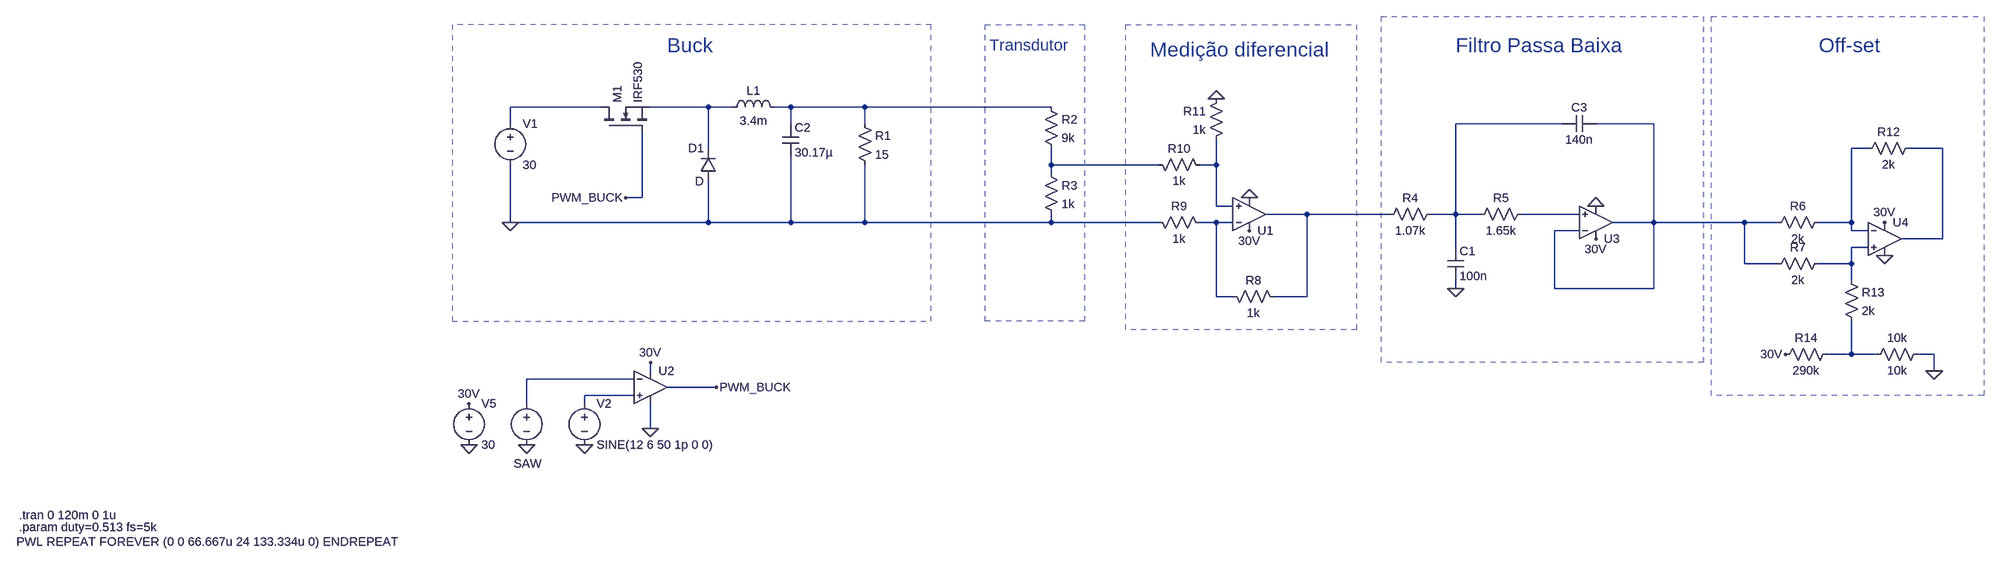
[diagram p0: schematic Buck.asc]
Buck.asc, the LTspice schematic file:
Version 4
SHEET 1 2788 1216
WIRE 96 64 -80 64
WIRE 304 64 192 64
WIRE 352 64 304 64
WIRE 464 64 432 64
WIRE 608 64 464 64
WIRE 976 64 608 64
WIRE -80 96 -80 64
WIRE 464 96 464 64
WIRE 608 96 608 64
WIRE 1968 96 1760 96
WIRE 2144 96 2032 96
WIRE 304 144 304 64
WIRE 2560 144 2528 144
WIRE 2704 144 2640 144
WIRE 976 176 976 144
WIRE 1184 176 976 176
WIRE 1296 176 1296 128
WIRE 1296 176 1264 176
WIRE 976 192 976 176
WIRE 176 240 176 112
WIRE 176 240 144 240
WIRE 1296 256 1296 176
WIRE 1328 256 1296 256
WIRE 1472 272 1392 272
WIRE 1632 272 1472 272
WIRE 1760 272 1760 96
WIRE 1760 272 1712 272
WIRE 1808 272 1760 272
WIRE 2000 272 1888 272
WIRE -80 288 -80 176
WIRE 304 288 304 208
WIRE 304 288 -80 288
WIRE 464 288 464 160
WIRE 464 288 304 288
WIRE 608 288 608 176
WIRE 608 288 464 288
WIRE 976 288 976 272
WIRE 976 288 608 288
WIRE 1184 288 976 288
WIRE 1296 288 1264 288
WIRE 1328 288 1296 288
WIRE 2144 288 2144 96
WIRE 2144 288 2064 288
WIRE 2320 288 2144 288
WIRE 2384 288 2320 288
WIRE 2528 288 2528 144
WIRE 2528 288 2464 288
WIRE 2000 304 1952 304
WIRE 2528 304 2528 288
WIRE 2560 304 2528 304
WIRE 2704 320 2704 144
WIRE 2704 320 2624 320
WIRE 1760 336 1760 272
WIRE 2560 336 2528 336
WIRE 2320 368 2320 288
WIRE 2384 368 2320 368
WIRE 2528 368 2528 336
WIRE 2528 368 2464 368
WIRE 2528 400 2528 368
WIRE 1760 416 1760 400
WIRE 1952 416 1952 304
WIRE 2144 416 2144 288
WIRE 2144 416 1952 416
WIRE 1296 432 1296 288
WIRE 1328 432 1296 432
WIRE 1472 432 1472 272
WIRE 1472 432 1408 432
WIRE 2528 544 2528 480
WIRE 2528 544 2480 544
WIRE 2576 544 2528 544
WIRE 2688 544 2656 544
WIRE 192 576 192 560
WIRE 2688 576 2688 544
WIRE 160 592 -48 592
WIRE 320 608 224 608
WIRE 160 624 64 624
WIRE -48 640 -48 592
WIRE 64 640 64 624
WIRE 192 688 192 640
FLAG -80 288 0
FLAG 64 720 0
FLAG -160 720 0
FLAG -48 720 0
FLAG 1296 48 0
FLAG 1360 240 0
FLAG 320 608 PWM_BUCK
FLAG 144 240 PWM_BUCK
FLAG -160 640 30V
FLAG 192 560 30V
FLAG 1360 304 30V
FLAG 2032 320 30V
FLAG 2032 256 0
FLAG 1760 416 0
FLAG 2592 352 0
FLAG 2592 288 30V
FLAG 2688 576 0
FLAG 2400 544 30V
FLAG 192 688 0
SYMBOL voltage -80 80 R0
WINDOW 123 0 0 Left 0
WINDOW 39 0 0 Left 0
SYMATTR InstName V1
SYMATTR Value 30
SYMBOL cap 448 96 R0
SYMATTR InstName C2
SYMATTR Value 30.17µ
SYMBOL res 592 80 R0
SYMATTR InstName R1
SYMATTR Value 15
SYMBOL ind 336 80 R270
WINDOW 0 32 56 VTop 2
WINDOW 3 5 56 VBottom 2
SYMATTR InstName L1
SYMATTR Value 3.4m
SYMBOL nmos 96 112 R270
SYMATTR InstName M1
SYMATTR Value IRF530
SYMBOL voltage -160 624 R0
WINDOW 123 0 0 Left 0
WINDOW 39 0 0 Left 0
SYMATTR InstName V5
SYMATTR Value 30
SYMBOL voltage -48 624 R0
WINDOW 0 -25 132 Left 2
WINDOW 3 -1061 284 Left 2
SYMATTR InstName SAW
SYMATTR Value PWL REPEAT FOREVER (0 0 66.667u 24 133.334u 0) ENDREPEAT
SYMBOL OpAmps\\UniversalOpAmp2 192 608 R0
SYMATTR InstName U2
SYMBOL res 960 48 R0
SYMATTR InstName R2
SYMATTR Value 9k
SYMBOL res 960 176 R0
SYMATTR InstName R3
SYMATTR Value 1k
SYMBOL res 1424 448 M270
WINDOW 0 32 56 VTop 2
WINDOW 3 0 56 VBottom 2
SYMATTR InstName R8
SYMATTR Value 1k
SYMBOL res 1280 304 M270
WINDOW 0 32 56 VTop 2
WINDOW 3 0 56 VBottom 2
SYMATTR InstName R9
SYMATTR Value 1k
SYMBOL res 1280 192 M270
WINDOW 0 32 56 VTop 2
WINDOW 3 0 56 VBottom 2
SYMATTR InstName R10
SYMATTR Value 1k
SYMBOL res 1312 32 M0
SYMATTR InstName R11
SYMATTR Value 1k
SYMBOL OpAmps\\UniversalOpAmp 1360 272 M180
SYMATTR InstName U1
SYMBOL diode 320 208 R180
WINDOW 0 24 64 Left 2
WINDOW 3 24 0 Left 2
SYMATTR InstName D1
SYMBOL voltage 64 624 R0
WINDOW 123 0 0 Left 0
WINDOW 39 0 0 Left 0
SYMATTR InstName V2
SYMATTR Value SINE(12 6 50 1p 0 0)
SYMBOL res 1728 256 R90
WINDOW 0 0 56 VBottom 2
WINDOW 3 32 56 VTop 2
SYMATTR InstName R4
SYMATTR Value 1.07k
SYMBOL res 1904 256 R90
WINDOW 0 0 56 VBottom 2
WINDOW 3 32 56 VTop 2
SYMATTR InstName R5
SYMATTR Value 1.65k
SYMBOL cap 1744 336 R0
SYMATTR InstName C1
SYMATTR Value 100n
SYMBOL OpAmps\\UniversalOpAmp 2032 288 M180
SYMATTR InstName U3
SYMBOL cap 2032 80 R90
WINDOW 0 0 32 VBottom 2
WINDOW 3 32 32 VTop 2
SYMATTR InstName C3
SYMATTR Value 140n
SYMBOL OpAmps\\UniversalOpAmp 2592 320 R0
SYMATTR InstName U4
SYMBOL res 2480 272 R90
WINDOW 0 0 56 VBottom 2
WINDOW 3 32 56 VTop 2
SYMATTR InstName R6
SYMATTR Value 2k
SYMBOL res 2480 352 R90
WINDOW 0 0 56 VBottom 2
WINDOW 3 32 56 VTop 2
SYMATTR InstName R7
SYMATTR Value 2k
SYMBOL res 2656 128 R90
WINDOW 0 0 56 VBottom 2
WINDOW 3 32 56 VTop 2
SYMATTR InstName R12
SYMATTR Value 2k
SYMBOL res 2512 384 R0
SYMATTR InstName R13
SYMATTR Value 2k
SYMBOL res 2496 528 R90
WINDOW 0 0 56 VBottom 2
WINDOW 3 32 56 VTop 2
SYMATTR InstName R14
SYMATTR Value 290k
SYMBOL res 2672 528 R90
WINDOW 0 0 56 VBottom 2
WINDOW 3 32 56 VTop 2
SYMATTR InstName 10k
SYMATTR Value 10k
TEXT -1104 856 Left 2 !.tran 0 120m 0 1u
TEXT -1104 880 Left 2 !.param duty=0.513 fs=5k
TEXT 856 -56 Left 3 ;Transdutor
TEXT 1168 -48 Left 4 ;Medição diferencial
TEXT 1760 -56 Left 4 ;Filtro Passa Baixa
TEXT 2464 -56 Left 4 ;Off-set
TEXT 224 -56 Left 4 ;Buck
RECTANGLE Normal -192 480 736 -96 2
RECTANGLE Normal 1040 480 848 -96 2
RECTANGLE Normal 1568 496 1120 -96 2
RECTANGLE Normal 2240 560 1616 -112 2
RECTANGLE Normal 2784 624 2256 -112 2

The netlist it stands for:
* Buck.asc
V1 N001 0 30
C2 N003 0 30.17µ
R1 N003 0 15
L1 N002 N003 3.4m
M1 N001 PWM_BUCK N002 N002 IRF530
V5 30V 0 30
V§SAW N015 0 PWL REPEAT FOREVER (0 0 66.667u 24 133.334u 0) ENDREPEAT
XU2 N016 N015 30V 0 PWM_BUCK level2 Avol=1Meg GBW=10Meg Slew=10Meg Ilimit=25m Rail=0 Vos=0 En=0 Enk=0 In=0 Ink=0 Rin=500Meg  ; pins In+ In- V+ V- OUT
R2 N003 N008 9k
R3 N008 0 1k
R8 N010 N012 1k
R9 N012 0 1k
R10 N009 N008 1k
R11 0 N009 1k
XU1 N009 N012 30V 0 N010 level1 Avol=1Meg GBW=10Meg Vos=0 En=0 Enk=0 In=0 Ink=0 Rin=500Meg  ; pins In+ In- V+ V- OUT
D1 0 N002 D
V2 N016 0 SINE(12 6 50 1p 0 0)
R4 N004 N010 1.07k
R5 N011 N004 1.65k
C1 N004 0 100n
XU3 N011 N005 30V 0 N005 level1 Avol=1Meg GBW=10Meg Vos=0 En=0 Enk=0 In=0 Ink=0 Rin=500Meg  ; pins In+ In- V+ V- OUT
C3 N005 N004 140n
XU4 N013 N006 30V 0 N007 level1 Avol=1Meg GBW=10Meg Vos=0 En=0 Enk=0 In=0 Ink=0 Rin=500Meg  ; pins In+ In- V+ V- OUT
R6 N006 N005 2k
R7 N013 N005 2k
R12 N007 N006 2k
R13 N013 N014 2k
R14 N014 30V 290k
R§10k 0 N014 10k
.model D D
.lib standard.dio
.model NMOS NMOS
.model PMOS PMOS
.lib standard.mos
.tran 0 120m 0 1u
.param duty=0.513 fs=5k
* Transdutor
* Medição diferencial
* Filtro Passa Baixa
* Off-set
* Buck
.lib UniversalOpAmp2.lib
.lib UniversalOpAmp1.lib
.backanno
.end